# Altium project PCB_TMET6000.PrjPcb
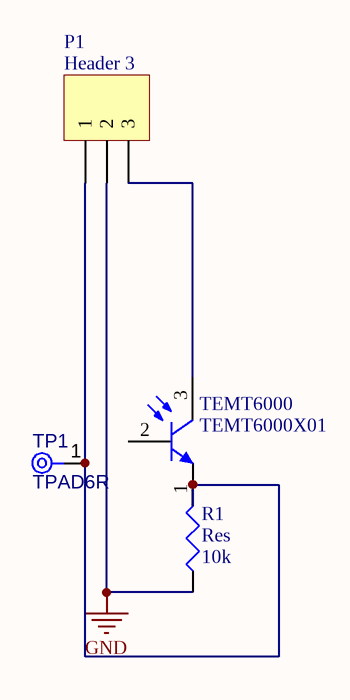
[diagram p0: SCH_TEMT6000.SchDoc]
1 sheet, 4 parts. Net scope: global (net labels, ports and power ports of the same name join across sheets).
Board file: PCB_TEMT6000.PcbDoc

## Sheet SCH_TEMT6000.SchDoc
size A4; SheetNumber: 1; SheetTotal: 1

### Parts
P1  Header 3  [HDR1X3]
R1  Res  value 10k  [J1-0603]
TEMT6000  TEMT6000X01  [VSIL-TEMT6000X01_V]
TP1  TPAD6R  [TP06R]  (no BOM)

### Nets
GND: P1.2 R1.1
NetP1_1: P1.1 R1.2 TEMT6000.1(E) TP1.1(TP)
NetP1_3: P1.3 TEMT6000.3(C)

Not connected (* = marked no-connect by the designer): TEMT6000 2(B)

### Library data of the parts
P1 = Header 3: Header, 3-Pin; LatestRevisionDate: 17-Jul-2002; LatestRevisionNote: Re-released for DXP Platform.; Publisher: Altium Limited
R1 = Res3: Resistor; Published: 8-Jun-2000; LatestRevisionDate: 29-May-2009; LatestRevisionNote: IPC-7351 Footprint Added.; PackageReference: J1-0603; Publisher: Altium Limited; PackageDescription: Chip Resistor
TEMT6000 = CMP-010-00016-3: Ambient Light Sensor, 100 mW, -40 to 100 degC, 3-Pin SMD, RoHS, Tape and Reel; Manufacturer: Vishay Siliconix; Datasheet Version: Rev. 1.9, 08/2011; Package Reference: 1206; RoHS Compliant: Unknown; Case/Package: 1206; Datasheet URL: http://www.vishay.com/docs/81579/temt6000.pdf; Package Description: 3-Pin Surface Mount Device, Body 4 x 2 mm; Sensor Type: Light; Mounting Technology: SM
TP1 = CMP-00028-00002-2: 0.6mm round; Pins: 1